# Altium schematic sheet Neopixel Class.SchDoc
size A; SheetNumber: 2; SheetTotal: 2
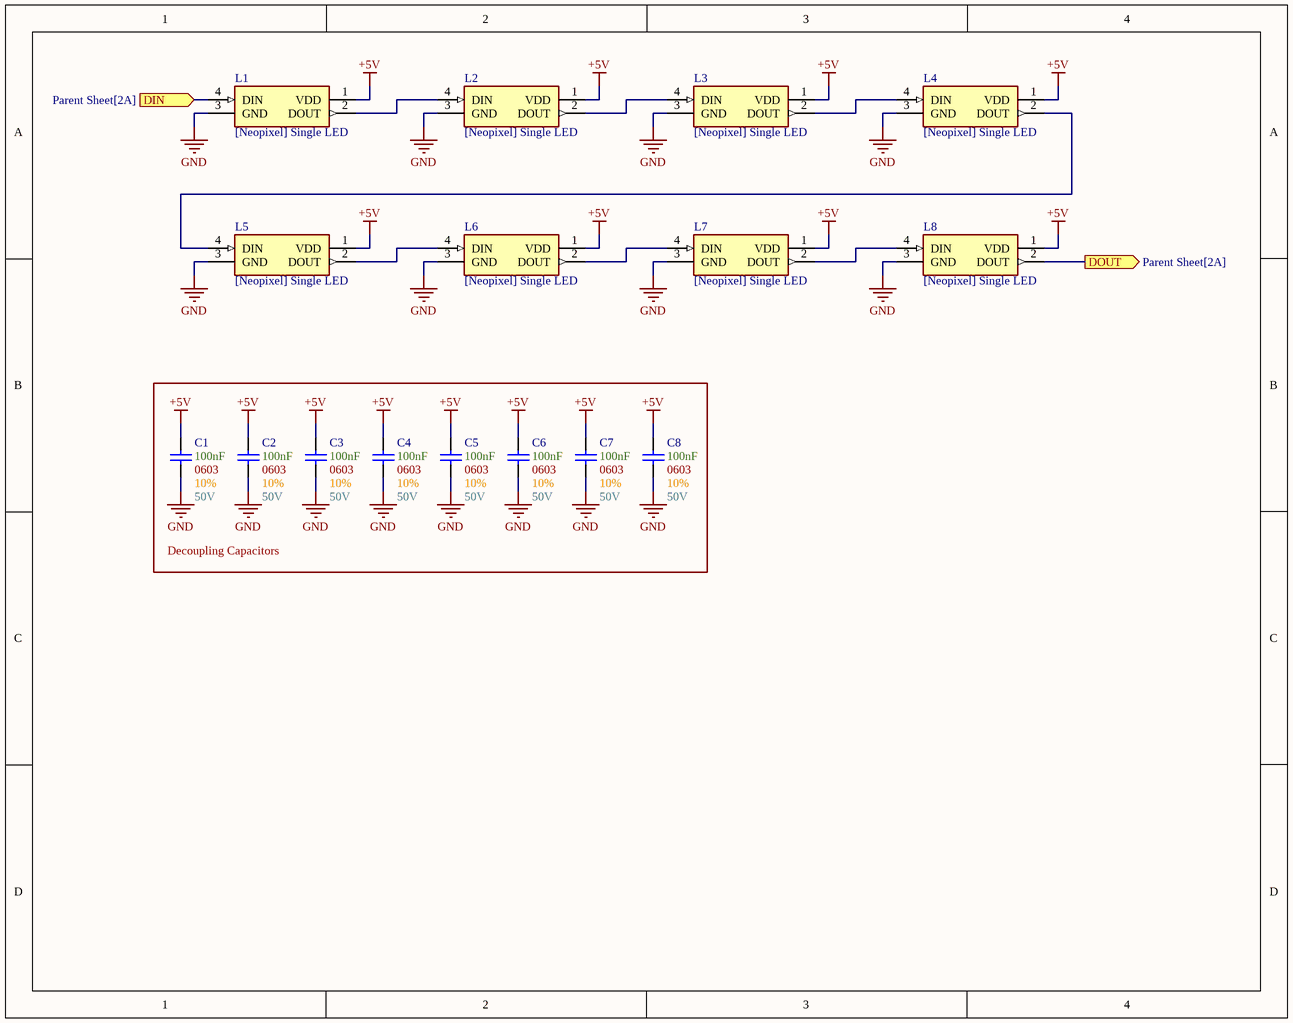
[diagram p0: Neopixel Class.SchDoc]

## Parts
C1  Max Voltage: 50V  Size Package: 0603  Tolerance: 10%  Capacitance: 100nF  [[Cap] SMD 0603]  (hidden comment: [Cap] 0603 0.1uF 10% 50V)
C2  Max Voltage: 50V  Size Package: 0603  Tolerance: 10%  Capacitance: 100nF  [[Cap] SMD 0603]  (hidden comment: [Cap] 0603 0.1uF 10% 50V)
C3  Max Voltage: 50V  Size Package: 0603  Tolerance: 10%  Capacitance: 100nF  [[Cap] SMD 0603]  (hidden comment: [Cap] 0603 0.1uF 10% 50V)
C4  Max Voltage: 50V  Size Package: 0603  Tolerance: 10%  Capacitance: 100nF  [[Cap] SMD 0603]  (hidden comment: [Cap] 0603 0.1uF 10% 50V)
C5  Max Voltage: 50V  Size Package: 0603  Tolerance: 10%  Capacitance: 100nF  [[Cap] SMD 0603]  (hidden comment: [Cap] 0603 0.1uF 10% 50V)
C6  Max Voltage: 50V  Size Package: 0603  Tolerance: 10%  Capacitance: 100nF  [[Cap] SMD 0603]  (hidden comment: [Cap] 0603 0.1uF 10% 50V)
C7  Max Voltage: 50V  Size Package: 0603  Tolerance: 10%  Capacitance: 100nF  [[Cap] SMD 0603]  (hidden comment: [Cap] 0603 0.1uF 10% 50V)
C8  Max Voltage: 50V  Size Package: 0603  Tolerance: 10%  Capacitance: 100nF  [[Cap] SMD 0603]  (hidden comment: [Cap] 0603 0.1uF 10% 50V)
L1  [Neopixel] Single LED  [[Neopixel] Single LED]
L2  [Neopixel] Single LED  [[Neopixel] Single LED]
L3  [Neopixel] Single LED  [[Neopixel] Single LED]
L4  [Neopixel] Single LED  [[Neopixel] Single LED]
L5  [Neopixel] Single LED  [[Neopixel] Single LED]
L6  [Neopixel] Single LED  [[Neopixel] Single LED]
L7  [Neopixel] Single LED  [[Neopixel] Single LED]
L8  [Neopixel] Single LED  [[Neopixel] Single LED]

## Blocks framed on the sheet
Decoupling Capacitors: C1-C8

## Ports
DIN (in, see Parent Sheet[2A]), DOUT (out, see Parent Sheet[2A])

## Nets
+5V: C1.2 C2.2 C3.2 C4.2 C5.2 C6.2 C7.2 C8.2 L1.1(VDD) L2.1(VDD) L3.1(VDD) L4.1(VDD) L5.1(VDD) L6.1(VDD) L7.1(VDD) L8.1(VDD)
GND: C1.1 C2.1 C3.1 C4.1 C5.1 C6.1 C7.1 C8.1 L1.3(GND) L2.3(GND) L3.3(GND) L4.3(GND) L5.3(GND) L6.3(GND) L7.3(GND) L8.3(GND)
DIN: L1.4(DIN) ; port DIN
DOUT: L8.2(DOUT) ; port DOUT
NetL1_2: L1.2(DOUT) L2.4(DIN)
NetL2_2: L2.2(DOUT) L3.4(DIN)
NetL3_2: L3.2(DOUT) L4.4(DIN)
NetL4_2: L4.2(DOUT) L5.4(DIN)
NetL5_2: L5.2(DOUT) L6.4(DIN)
NetL6_2: L6.2(DOUT) L7.4(DIN)
NetL7_2: L7.2(DOUT) L8.4(DIN)

## Library data of the parts
C1-C8 = [Cap] 0603 0.1uF 10% 50V: CL10B104KB8NNNC; Supplier 1: DigiKey; Supplier Part Number 1: 1276-1000-6-ND
L1-L8 = [Neopixel] Single LED: WS2812B; Supplier 1: DigiKey; Supplier Part Number 1: 1568-16347CT-ND